# Altium project GeminiBoard.PrjPcb
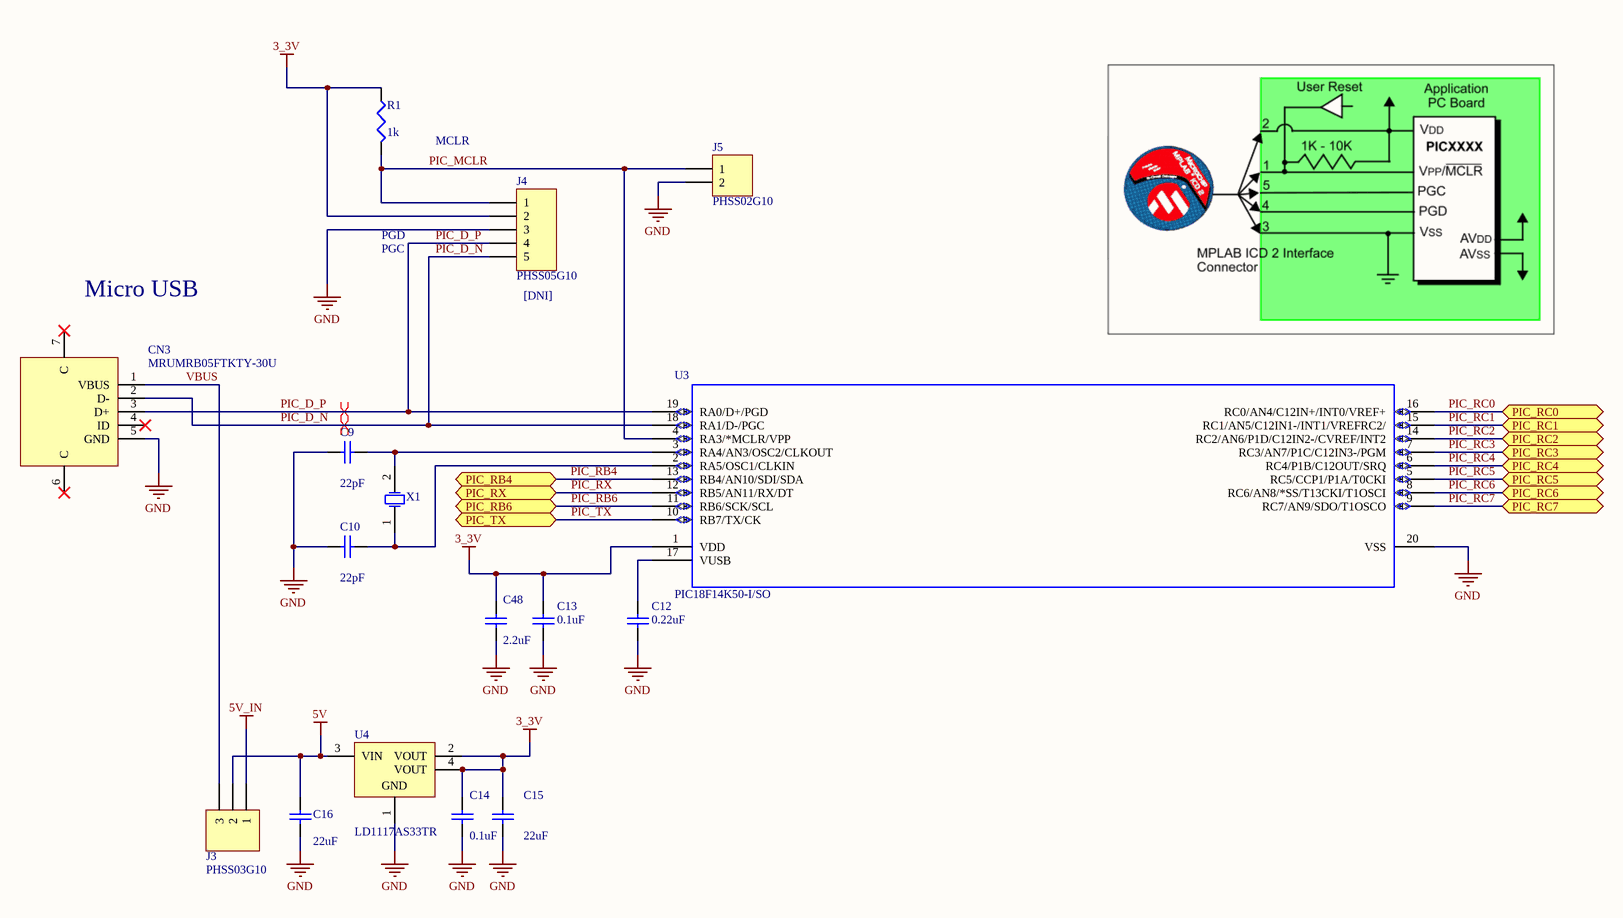
[diagram p0: Sheet1.SchDoc]
5 sheets, 117 parts. Net scope: flat (ports and power ports of the same name join across sheets).
Board file: PCB1.PcbDoc
Sheets:
  Sheet1.SchDoc
  Sheet2.SchDoc
  Sheet3.SchDoc
  Sheet4.SchDoc
  Sheet5.SchDoc

## Sheet Sheet1.SchDoc
size A3

### Parts
C9  value 22pF  [CHIP1608]  (hidden comment: 06035A220JAT2A)
C10  value 22pF  [CHIP1608]  (hidden comment: 06035A220JAT2A)
C12  value 0.22uF  [CHIP1608]  (hidden comment: CC0603ZRY5V7BB224)
C13  value 0.1uF  [CHIP1608]  (hidden comment: MC0603B104M160CT)
C14  value 0.1uF  [CHIP1608]  (hidden comment: MC0603B104M160CT)
C15  value 22uF  [CHIP3216]  (hidden comment: MC1206F226Z100CT)
C16  value 22uF  [CHIP3216]  (hidden comment: MC1206F226Z100CT)
C48  value 2.2uF  [CHIP1608]  (hidden comment: MC0603B225K6R3CT)
CN3  MRUMRB05FTKTY-30U  [MRUMRB05FTKTY-30U]
J3  PHSS03G10  [HDR1X3]
J4  PHSS05G10  assembly: [DNI]  [HDR1X5]
J5  PHSS02G10  [HDR1X2]
R1  value 1k  [CHIP1608]  (hidden comment: MCMR06X1001FTL)
U3  PIC18F14K50-I/SO  [PIC18F14K50-SO]
U4  LD1117AS33TR  [SOT-223_N]
X1  SMD49S-12M1630F  [ABLS-25.000MHZ-B2F-T]  (value not drawn)

### Ports
PIC_RB4, PIC_RB6, PIC_RC0, PIC_RC1, PIC_RC2, PIC_RC3, PIC_RC4, PIC_RC5, PIC_RC6, PIC_RC7, PIC_RX, PIC_TX

### Nets
3_3V: C13.2 C14.2 C15.2 C48.2 J4.2 R1.1 U3.1(VDD) U4.2(VOUT) U4.4(VOUT)
5V: C16.2 J3.2 U4.3(VIN)
5V_IN: J3.1
GND: C9.1 C10.1 C12.1 C13.1 C14.1 C15.1 C16.1 C48.1 CN3.5(GND) J4.3 J5.2 U3.20(VSS) U4.1(GND)
PIC_D_N: CN3.2(D-) J4.5 U3.18(RA1/D-/PGC)
PIC_D_P: CN3.3(D+) J4.4 U3.19(RA0/D+/PGD)
PIC_MCLR: J4.1 J5.1 R1.2 U3.4(RA3/*MCLR/VPP)
PIC_RB4: U3.13(RB4/AN10/SDI/SDA) ; port PIC_RB4
PIC_RB6: U3.11(RB6/SCK/SCL) ; port PIC_RB6
PIC_RC0: U3.16(RC0/AN4/C12IN+/INT0/VREF+) ; port PIC_RC0
PIC_RC1: U3.15(RC1/AN5/C12IN1-/INT1/VREFRC2/) ; port PIC_RC1
PIC_RC2: U3.14(RC2/AN6/P1D/C12IN2-/CVREF/INT2) ; port PIC_RC2
PIC_RC3: U3.7(RC3/AN7/P1C/C12IN3-/PGM) ; port PIC_RC3
PIC_RC4: U3.6(RC4/P1B/C12OUT/SRQ) ; port PIC_RC4
PIC_RC5: U3.5(RC5/CCP1/P1A/T0CKI) ; port PIC_RC5
PIC_RC6: U3.8(RC6/AN8/*SS/T13CKI/T1OSCI) ; port PIC_RC6
PIC_RC7: U3.9(RC7/AN9/SDO/T1OSCO) ; port PIC_RC7
PIC_RX: U3.12(RB5/AN11/RX/DT) ; port PIC_RX
PIC_TX: U3.10(RB7/TX/CK) ; port PIC_TX
VBUS: CN3.1(VBUS) J3.3
NetC9_2: C9.2 U3.3(RA4/AN3/OSC2/CLKOUT) X1.2(OSC2)
NetC10_2: C10.2 U3.2(RA5/OSC1/CLKIN) X1.1(OSC1)
NetC12_2: C12.2 U3.17(VUSB)

Not connected (* = marked no-connect by the designer): CN3 4(ID)* 6(C)* 7(C)*

### Layout directives
differential pair: PIC_D_N, PIC_D_P

### Notes on the sheet
- MCLR
- PGD
- PGC
- Micro USB

### Library data of the parts
C9 C10 C13 = Cap Semi: Capacitor (Semiconductor SIM Model); Published: 8-Jun-2000; LatestRevisionDate: 17-Jul-2002; LatestRevisionNote: Re-released for DXP Platform.; PackageReference: C1206; Publisher: Altium Limited
  C9 C10: part2: CC0603JRNPO9BN220
  C13: part2: CC0603KRX7R9BB104
C12 C14-C16 C48 = Cap Semi: Capacitor (Semiconductor SIM Model); Vendor: element14(GTI); Published: 8-Jun-2000; LatestRevisionDate: 17-Jul-2002; LatestRevisionNote: Re-released for DXP Platform.; PackageReference: C1206; Publisher: Altium Limited
  C12: part2: CC0603KRX7R8BB224
  C14: part2: CC0603KRX7R9BB104
  C15 C16: part2: CC1206KKX5R8BB226
  C48: part2: CC0603KRX7R6BB225
CN3 = MicroUSBTypeB: Vendor: ES; part2: 10118192-0001LF
J3 = Header 3: Header, 3-Pin; Vendor: ES; LatestRevisionDate: 17-Jul-2002; LatestRevisionNote: Re-released for DXP Platform.; Publisher: Altium Limited
J4 = Header 5: Header, 5-Pin; Vendor: ES; LatestRevisionDate: 17-Jul-2002; LatestRevisionNote: Re-released for DXP Platform.; Publisher: Altium Limited
J5 = Header 2: Header, 2-Pin; Vendor: ES; LatestRevisionDate: 17-Jul-2002; LatestRevisionNote: Re-released for DXP Platform.; Publisher: Altium Limited
R1 = Res3: Resistor; Published: 8-Jun-2000; LatestRevisionDate: 04-Mar-2005; LatestRevisionNote: PCB Footprint replaced.; PackageReference: J1-0603; Publisher: Altium Limited; part2: RC0603JR-071KL
U3 = PIC18F14K50: MICROCHIPS; Vendor: ES; part2: PIC18F14K50-I/SO
U4 = LD1117AS33TR: 1A, Low Drop Positive Voltage Regulator, 3.3V, 4-Pin SOT-223, Tape and Reel; Vendor: ES; DatasheetVersion: Dec-2011; PackageVersion: 2010; PackageReference: SOT-223; PackageDescription: 4-Pin SOT-223 Package, 6.5 x 3.5 mm Body, 2.3 mm Pitch, 7 mm Lead Span; PartNumber: LD1117AS33TR; ComponentLink1Description: Manufacturer URL; ComponentLink1URL: http://www.st.com; ComponentLink2Description: Datasheet; ComponentLink2URL: http://www.st.com/internet/com/TECHNICAL_RESOURCES/TECHNICAL_LITERATURE/DATASHEET/CD00002116.pdf; part2: LD1117AS33TR
X1 = ABLS-25.000MHZ-B2F-T: MEC; Vendor: ES; part2: ABLS-12.000MHZ-B4-T

## Sheet Sheet2.SchDoc
size A3
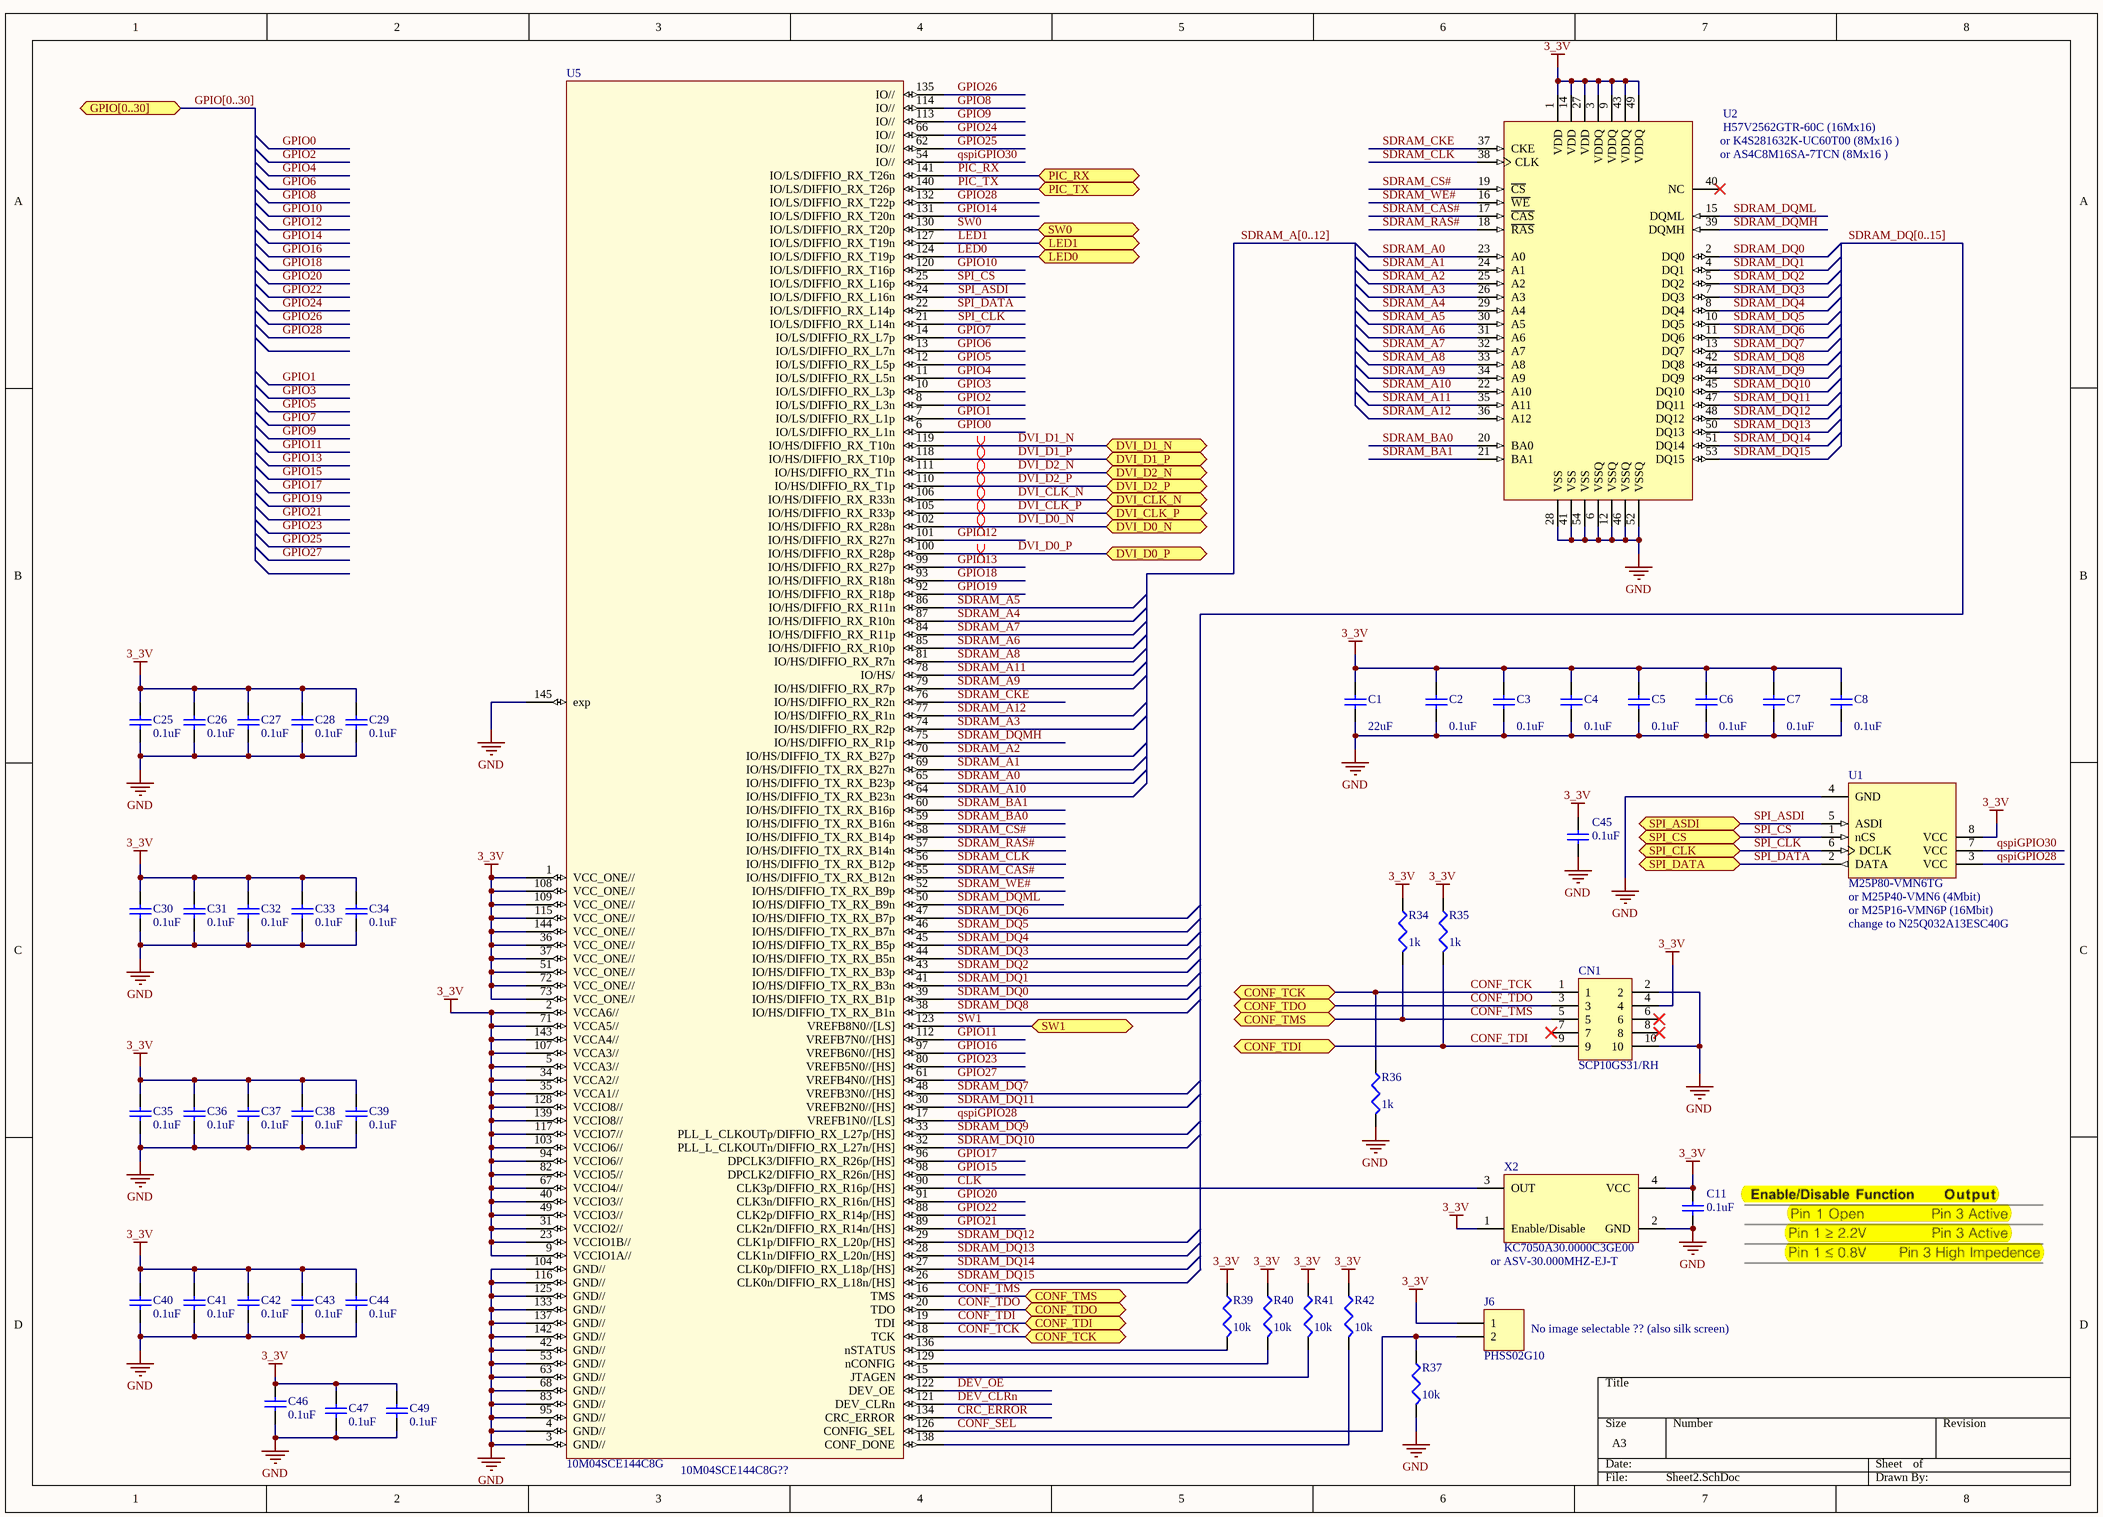
[diagram p1: Sheet2.SchDoc]

### Parts
C1  value 22uF  [CHIP3216]  (hidden comment: MC1206F226Z100CT)
C2  value 0.1uF  [CHIP1608]  (hidden comment: MC0603B104M160CT)
C3  value 0.1uF  [CHIP1608]  (hidden comment: MC0603B104M160CT)
C4  value 0.1uF  [CHIP1608]  (hidden comment: MC0603B104M160CT)
C5  value 0.1uF  [CHIP1608]  (hidden comment: MC0603B104M160CT)
C6  value 0.1uF  [CHIP1608]  (hidden comment: MC0603B104M160CT)
C7  value 0.1uF  [CHIP1608]  (hidden comment: MC0603B104M160CT)
C8  value 0.1uF  [CHIP1608]  (hidden comment: MC0603B104M160CT)
C11  value 0.1uF  [CHIP1608]  (hidden comment: MC0603B104M160CT)
C25  value 0.1uF  [CHIP1608]  (hidden comment: MC0603B104M160CT)
C26  value 0.1uF  [CHIP1608]  (hidden comment: MC0603B104M160CT)
C27  value 0.1uF  [CHIP1608]  (hidden comment: MC0603B104M160CT)
C28  value 0.1uF  [CHIP1608]  (hidden comment: MC0603B104M160CT)
C29  value 0.1uF  [CHIP1608]  (hidden comment: MC0603B104M160CT)
C30  value 0.1uF  [CHIP1608]  (hidden comment: MC0603B104M160CT)
C31  value 0.1uF  [CHIP1608]  (hidden comment: MC0603B104M160CT)
C32  value 0.1uF  [CHIP1608]  (hidden comment: MC0603B104M160CT)
C33  value 0.1uF  [CHIP1608]  (hidden comment: MC0603B104M160CT)
C34  value 0.1uF  [CHIP1608]  (hidden comment: MC0603B104M160CT)
C35  value 0.1uF  [CHIP1608]  (hidden comment: MC0603B104M160CT)
C36  value 0.1uF  [CHIP1608]  (hidden comment: MC0603B104M160CT)
C37  value 0.1uF  [CHIP1608]  (hidden comment: MC0603B104M160CT)
C38  value 0.1uF  [CHIP1608]  (hidden comment: MC0603B104M160CT)
C39  value 0.1uF  [CHIP1608]  (hidden comment: MC0603B104M160CT)
C40  value 0.1uF  [CHIP1608]  (hidden comment: MC0603B104M160CT)
C41  value 0.1uF  [CHIP1608]  (hidden comment: MC0603B104M160CT)
C42  value 0.1uF  [CHIP1608]  (hidden comment: MC0603B104M160CT)
C43  value 0.1uF  [CHIP1608]  (hidden comment: MC0603B104M160CT)
C44  value 0.1uF  [CHIP1608]  (hidden comment: MC0603B104M160CT)
C45  value 0.1uF  [CHIP1608]  (hidden comment: MC0603B104M160CT)
C46  value 0.1uF  [CHIP1608]  (hidden comment: MC0603B104M160CT)
C47  value 0.1uF  [CHIP1608]  (hidden comment: MC0603B104M160CT)
C49  value 0.1uF  [CHIP1608]  (hidden comment: MC0603B104M160CT)
CN1  SCP10GS31/RH  [SCP10GS31/RH]
J6  PHSS02G10  [HDR1X2]
R34  value 1k  [CHIP1608]  (hidden comment: MCMR06X1001FTL)
R35  value 1k  [CHIP1608]  (hidden comment: MCMR06X1001FTL)
R36  value 1k  [CHIP1608]  (hidden comment: MCMR06X1001FTL)
R37  value 10k  [CHIP1608]  (hidden comment: MCWR06X1002FTL)
R39  value 10k  [CHIP1608]  (hidden comment: MCWR06X1002FTL)
R40  value 10k  [CHIP1608]  (hidden comment: MCWR06X1002FTL)
R41  value 10k  [CHIP1608]  (hidden comment: MCWR06X1002FTL)
R42  value 10k  [CHIP1608]  (hidden comment: MCWR06X1002FTL)
U1  M25P80-VMN6TG  [SOIC8_L]
U2  H57V2562GTR-60C (16Mx16)  [TSOP2-54_M]
U5  10M04SCE144C8G  [TEST2]
X2  KC7050A30.0000C3GE00  [CWX823-50.0M]

### Ports
CONF_TCK, CONF_TDI, CONF_TDO, CONF_TMS, DVI_CLK_N, DVI_CLK_P, DVI_D0_N, DVI_D0_P, DVI_D1_N, DVI_D1_P, DVI_D2_N, DVI_D2_P, GPIO[0..30], LED0, LED1, PIC_RX, PIC_TX, SPI_ASDI, SPI_CLK, SPI_CS, SPI_DATA, SW0, SW1

### Nets
3_3V: C1.2 C2.2 C3.2 C4.2 C5.2 C6.2 C7.2 C8.2 C11.2 C25.1 C26.1 C27.1 C28.1 C29.1 C30.1 C31.1 C32.1 C33.1 C34.1 C35.1 C36.1 C37.1 C38.1 C39.1 C40.1 C41.1 C42.1 C43.1 C44.1 C45.2 C46.1 C47.1 C49.1 CN1.4 J6.1 R34.1 R35.1 R39.1 R40.1 R41.1 R42.1 U1.8(VCC) U2.1(VDD) U2.3(VDDQ) U2.9(VDDQ) U2.14(VDD) U2.27(VDD) U2.43(VDDQ) U2.49(VDDQ) U5.1(VCC_ONE//) U5.2(VCCA6//) U5.5(VCCA3//) U5.9(VCCIO1A//) U5.23(VCCIO1B//) U5.31(VCCIO2//) U5.34(VCCA2//) U5.35(VCCA1//) U5.36(VCC_ONE//) U5.37(VCC_ONE//) U5.40(VCCIO3//) U5.49(VCCIO3//) U5.51(VCC_ONE//) U5.67(VCCIO4//) U5.71(VCCA5//) U5.72(VCC_ONE//) U5.73(VCC_ONE//) U5.82(VCCIO5//) U5.94(VCCIO6//) U5.103(VCCIO6//) U5.107(VCCA3//) U5.108(VCC_ONE//) U5.109(VCC_ONE//) U5.115(VCC_ONE//) U5.117(VCCIO7//) U5.128(VCCIO8//) U5.139(VCCIO8//) U5.143(VCCA4//) U5.144(VCC_ONE//) X2.1(Enable/Disable) X2.4(VCC)
GND: C1.1 C2.1 C3.1 C4.1 C5.1 C6.1 C7.1 C8.1 C11.1 C25.2 C26.2 C27.2 C28.2 C29.2 C30.2 C31.2 C32.2 C33.2 C34.2 C35.2 C36.2 C37.2 C38.2 C39.2 C40.2 C41.2 C42.2 C43.2 C44.2 C45.1 C46.2 C47.2 C49.2 CN1.2 CN1.10 R36.2 R37.2 U1.4(GND) U2.6(VSSQ) U2.12(VSSQ) U2.28(VSS) U2.41(VSS) U2.46(VSSQ) U2.52(VSSQ) U2.54(VSS) U5.3(GND//) U5.4(GND//) U5.42(GND//) U5.53(GND//) U5.63(GND//) U5.68(GND//) U5.83(GND//) U5.95(GND//) U5.104(GND//) U5.116(GND//) U5.125(GND//) U5.133(GND//) U5.137(GND//) U5.142(GND//) U5.145(exp) X2.2(GND)
CLK: U5.90(CLK3p/DIFFIO_RX_R16p/[HS]) X2.3(OUT)
CONF_SEL: J6.2 R37.1 U5.126(CONFIG_SEL)
CONF_TCK: CN1.1 R36.1 U5.18(TCK) ; port CONF_TCK
CONF_TDI: CN1.9 R35.2 U5.19(TDI) ; port CONF_TDI
CONF_TDO: CN1.3 U5.20(TDO) ; port CONF_TDO
CONF_TMS: CN1.5 R34.2 U5.16(TMS) ; port CONF_TMS
CRC_ERROR: U5.134(CRC_ERROR)
DEV_CLRn: U5.121(DEV_CLRn)
DEV_OE: U5.122(DEV_OE)
DVI_CLK_N: U5.106(IO/HS/DIFFIO_RX_R33n) ; port DVI_CLK_N
DVI_CLK_P: U5.105(IO/HS/DIFFIO_RX_R33p) ; port DVI_CLK_P
DVI_D0_N: U5.102(IO/HS/DIFFIO_RX_R28n) ; port DVI_D0_N
DVI_D0_P: U5.100(IO/HS/DIFFIO_RX_R28p) ; port DVI_D0_P
DVI_D1_N: U5.119(IO/HS/DIFFIO_RX_T10n) ; port DVI_D1_N
DVI_D1_P: U5.118(IO/HS/DIFFIO_RX_T10p) ; port DVI_D1_P
DVI_D2_N: U5.111(IO/HS/DIFFIO_RX_T1n) ; port DVI_D2_N
DVI_D2_P: U5.110(IO/HS/DIFFIO_RX_T1p) ; port DVI_D2_P
GPIO0: U5.6(IO/LS/DIFFIO_RX_L1n)
GPIO1: U5.7(IO/LS/DIFFIO_RX_L1p)
GPIO2: U5.8(IO/LS/DIFFIO_RX_L3n)
GPIO3: U5.10(IO/LS/DIFFIO_RX_L3p)
GPIO4: U5.11(IO/LS/DIFFIO_RX_L5n)
GPIO5: U5.12(IO/LS/DIFFIO_RX_L5p)
GPIO6: U5.13(IO/LS/DIFFIO_RX_L7n)
GPIO7: U5.14(IO/LS/DIFFIO_RX_L7p)
GPIO8: U5.114(IO//)
GPIO9: U5.113(IO//)
GPIO10: U5.120(IO/LS/DIFFIO_RX_T16p)
GPIO11: U5.112(VREFB7N0//[HS])
GPIO12: U5.101(IO/HS/DIFFIO_RX_R27n)
GPIO13: U5.99(IO/HS/DIFFIO_RX_R27p)
GPIO14: U5.131(IO/LS/DIFFIO_RX_T20n)
GPIO15: U5.98(DPCLK2/DIFFIO_RX_R26n/[HS])
GPIO16: U5.97(VREFB6N0//[HS])
GPIO17: U5.96(DPCLK3/DIFFIO_RX_R26p/[HS])
GPIO18: U5.93(IO/HS/DIFFIO_RX_R18n)
GPIO19: U5.92(IO/HS/DIFFIO_RX_R18p)
GPIO20: U5.91(CLK3n/DIFFIO_RX_R16n/[HS])
GPIO21: U5.89(CLK2n/DIFFIO_RX_R14n/[HS])
GPIO22: U5.88(CLK2p/DIFFIO_RX_R14p/[HS])
GPIO23: U5.80(VREFB5N0//[HS])
GPIO24: U5.66(IO//)
GPIO25: U5.62(IO//)
GPIO26: U5.135(IO//)
GPIO27: U5.61(VREFB4N0//[HS])
GPIO28: U5.132(IO/LS/DIFFIO_RX_T22p)
LED0: U5.124(IO/LS/DIFFIO_RX_T19p) ; port LED0
LED1: U5.127(IO/LS/DIFFIO_RX_T19n) ; port LED1
PIC_RX: U5.141(IO/LS/DIFFIO_RX_T26n) ; port PIC_RX
PIC_TX: U5.140(IO/LS/DIFFIO_RX_T26p) ; port PIC_TX
qspiGPIO28: U1.3(VCC) U5.17(VREFB1N0//[LS])
qspiGPIO30: U1.7(VCC) U5.54(IO//)
SDRAM_A0: U2.23(A0) U5.65(IO/HS/DIFFIO_TX_RX_B23p)
SDRAM_A1: U2.24(A1) U5.69(IO/HS/DIFFIO_TX_RX_B27n)
SDRAM_A2: U2.25(A2) U5.70(IO/HS/DIFFIO_TX_RX_B27p)
SDRAM_A3: U2.26(A3) U5.74(IO/HS/DIFFIO_RX_R2p)
SDRAM_A4: U2.29(A4) U5.87(IO/HS/DIFFIO_RX_R10n)
SDRAM_A5: U2.30(A5) U5.86(IO/HS/DIFFIO_RX_R11n)
SDRAM_A6: U2.31(A6) U5.85(IO/HS/DIFFIO_RX_R10p)
SDRAM_A7: U2.32(A7) U5.84(IO/HS/DIFFIO_RX_R11p)
SDRAM_A8: U2.33(A8) U5.81(IO/HS/DIFFIO_RX_R7n)
SDRAM_A9: U2.34(A9) U5.79(IO/HS/DIFFIO_RX_R7p)
SDRAM_A10: U2.22(A10) U5.64(IO/HS/DIFFIO_TX_RX_B23n)
SDRAM_A11: U2.35(A11) U5.78(IO/HS/)
SDRAM_A12: U2.36(A12) U5.77(IO/HS/DIFFIO_RX_R1n)
SDRAM_BA0: U2.20(BA0) U5.59(IO/HS/DIFFIO_TX_RX_B16n)
SDRAM_BA1: U2.21(BA1) U5.60(IO/HS/DIFFIO_TX_RX_B16p)
SDRAM_CAS#: U2.17(~{CAS}) U5.55(IO/HS/DIFFIO_TX_RX_B12n)
SDRAM_CKE: U2.37(CKE) U5.76(IO/HS/DIFFIO_RX_R2n)
SDRAM_CLK: U2.38(CLK) U5.56(IO/HS/DIFFIO_TX_RX_B12p)
SDRAM_CS#: U2.19(~{CS}) U5.58(IO/HS/DIFFIO_TX_RX_B14p)
SDRAM_DQ0: U2.2(DQ0) U5.39(IO/HS/DIFFIO_TX_RX_B1p)
SDRAM_DQ1: U2.4(DQ1) U5.41(IO/HS/DIFFIO_TX_RX_B3n)
SDRAM_DQ2: U2.5(DQ2) U5.43(IO/HS/DIFFIO_TX_RX_B3p)
SDRAM_DQ3: U2.7(DQ3) U5.44(IO/HS/DIFFIO_TX_RX_B5n)
SDRAM_DQ4: U2.8(DQ4) U5.45(IO/HS/DIFFIO_TX_RX_B5p)
SDRAM_DQ5: U2.10(DQ5) U5.46(IO/HS/DIFFIO_TX_RX_B7n)
SDRAM_DQ6: U2.11(DQ6) U5.47(IO/HS/DIFFIO_TX_RX_B7p)
SDRAM_DQ7: U2.13(DQ7) U5.48(VREFB3N0//[HS])
SDRAM_DQ8: U2.42(DQ8) U5.38(IO/HS/DIFFIO_TX_RX_B1n)
SDRAM_DQ9: U2.44(DQ9) U5.33(PLL_L_CLKOUTp/DIFFIO_RX_L27p/[HS])
SDRAM_DQ10: U2.45(DQ10) U5.32(PLL_L_CLKOUTn/DIFFIO_RX_L27n/[HS])
SDRAM_DQ11: U2.47(DQ11) U5.30(VREFB2N0//[HS])
SDRAM_DQ12: U2.48(DQ12) U5.29(CLK1p/DIFFIO_RX_L20p/[HS])
SDRAM_DQ13: U2.50(DQ13) U5.28(CLK1n/DIFFIO_RX_L20n/[HS])
SDRAM_DQ14: U2.51(DQ14) U5.27(CLK0p/DIFFIO_RX_L18p/[HS])
SDRAM_DQ15: U2.53(DQ15) U5.26(CLK0n/DIFFIO_RX_L18n/[HS])
SDRAM_DQMH: U2.39(DQMH) U5.75(IO/HS/DIFFIO_RX_R1p)
SDRAM_DQML: U2.15(DQML) U5.50(IO/HS/DIFFIO_TX_RX_B9n)
SDRAM_RAS#: U2.18(~{RAS}) U5.57(IO/HS/DIFFIO_TX_RX_B14n)
SDRAM_WE#: U2.16(~{WE}) U5.52(IO/HS/DIFFIO_TX_RX_B9p)
SPI_ASDI: U1.5(ASDI) U5.24(IO/LS/DIFFIO_RX_L16n) ; port SPI_ASDI
SPI_CLK: U1.6(DCLK) U5.21(IO/LS/DIFFIO_RX_L14n) ; port SPI_CLK
SPI_CS: U1.1(nCS) U5.25(IO/LS/DIFFIO_RX_L16p) ; port SPI_CS
SPI_DATA: U1.2(DATA) U5.22(IO/LS/DIFFIO_RX_L14p) ; port SPI_DATA
SW0: U5.130(IO/LS/DIFFIO_RX_T20p) ; port SW0
SW1: U5.123(VREFB8N0//[LS]) ; port SW1
NetR39_2: R39.2 U5.136(nSTATUS)
NetR40_2: R40.2 U5.129(nCONFIG)
NetR41_2: R41.2 U5.15(JTAGEN)
NetR42_2: R42.2 U5.138(CONF_DONE)

Not connected (* = marked no-connect by the designer): CN1 6* 7* 8*; U2 40(NC)*

### Buses and harness runs
bus GPIO[0..30] = port GPIO[0..30]
bus SDRAM_A[0..12]
bus SDRAM_DQ[0..15]

### Layout directives
differential pair: DVI_CLK_N, DVI_CLK_P, DVI_D0_N, DVI_D0_P, DVI_D1_N, DVI_D1_P, DVI_D2_N, DVI_D2_P

### Notes on the sheet
- (near U2) or K4S281632K-UC60T00 (8Mx16 )
- (near U2) or AS4C8M16SA-7TCN (8Mx16 )
- (near U1) or M25P40-VMN6 (4Mbit)
- (near U1) or M25P16-VMN6P (16Mbit)
- change to N25Q032A13ESC40G
- (near X2) or ASV-30.000MHZ-EJ-T
- (near J6) No image selectable ?? (also silk screen)
- (near U5) 10M04SCE144C8G??

### Library data of the parts
C1 = Cap Semi: as C12 on sheet Sheet1; Published: 8-Jun-2000; LatestRevisionDate: 17-Jul-2002; LatestRevisionNote: Re-released for DXP Platform.; PackageReference: C1206; Publisher: Altium Limited; part2: CC1206KKX5R8BB226
C2-C8 C11 C25-C47 C49 = Cap Semi: Capacitor (Semiconductor SIM Model); Published: 8-Jun-2000; LatestRevisionDate: 17-Jul-2002; LatestRevisionNote: Re-released for DXP Platform.; PackageReference: C1206; Publisher: Altium Limited; part2: CC0603KRX7R9BB104
CN1 = SCP10GS31/RH: GTK; Vendor: ES
J6 = Header 2: Header, 2-Pin; Vendor: ES; LatestRevisionDate: 17-Jul-2002; LatestRevisionNote: Re-released for DXP Platform.; Publisher: Altium Limited
R34-R37 R39-R42 = Res3: Resistor; Published: 8-Jun-2000; LatestRevisionDate: 04-Mar-2005; LatestRevisionNote: PCB Footprint replaced.; PackageReference: J1-0603; Publisher: Altium Limited
  R34-R36: part2: RC0603JR-071KL
  R37 R39-R42: part2: RC0603JR-0710KL
U1 = EPCS1SI8: ALTERA EPCS1 Series, In-system programmable 3.3V serial configuration device, 8-Pin SOIC, 1-Megabit, Industrial Grade; Configures: Cyclone II, Stratix II, & Cyclone Devices; Vendor: ES or RS; Published: 17-Sep-2003; LatestRevisionDate: 13-Apr-2006; LatestRevisionNote: IPC-7351 Footprint Added.; DatasheetVersion: ver2.0, Oct-2003; PackageVersion: ver13.0, May-2005; PackageReference: SOIC8; Publisher: Altium Limited; PackageDescription: 8-Pin Small Outline Integrated Circuit Package (SOIC8); Code_JEDEC: MS-012-AA; Code_IPC: SOIC127P600-8; ComponentLink1Description: Manufacturer Link; ComponentLink1URL: http://www.altera.com/products/devices/config/cfg-index.html; ComponentLink2Description: Configuration Handbook; ComponentLink2URL: http://www.altera.com/literature/hb/cfg/config_handbook.pdf; ComponentLink3Description: Pinout Specification; ComponentLink3URL: http://www.altera.com/literature/hb/cfg/cyc_c51014.pdf; ComponentLink4Description: Packaging Specification; ComponentLink4URL: http://www.altera.com/literature/ds/dspkg.pdf; part2: N25Q032A13ESC40G
U2 = MT48LC16M16A2TG-75: MICRON; CycleTime: 7.5ns @ CL = 3 (PC133); RowAddress: 8K (A0-A12); ColumnAddress: 512 (A0-A8); Vendor: ES; Published: 11-Oct-2004; LatestRevisionDate: 13-Apr-2006; LatestRevisionNote: IPC-7351 Footprint Added.; DatasheetVersion: rev.G, Sep-2003; PackageVersion: Sep-2003; PackageReference: TSOP2-54; Publisher: Altium Limited; PackageDescription: 54-Pin Plastic Small Outline Package 0.8 mm Pitch; Code_JEDEC: MS-024-FA; ComponentLink1Description: Manufacturer Link; ComponentLink1URL: http://www.micron.com; ComponentLink2Description: Datasheet; ComponentLink2URL: http://download.micron.com/pdf/datasheets/dram/sdram/256MSDRAM.pdf; part2: AS4C8M16SA-7TCN
U5 = MAX10: Vendor: Mouser; part2: 10M04SCE144C8G
X2 = CWX823-50.0M: CONNOR-WINFIELD; Vendor: ES; part2: ASV-30.000MHZ-EJ-T

## Sheet Sheet3.SchDoc
size A3
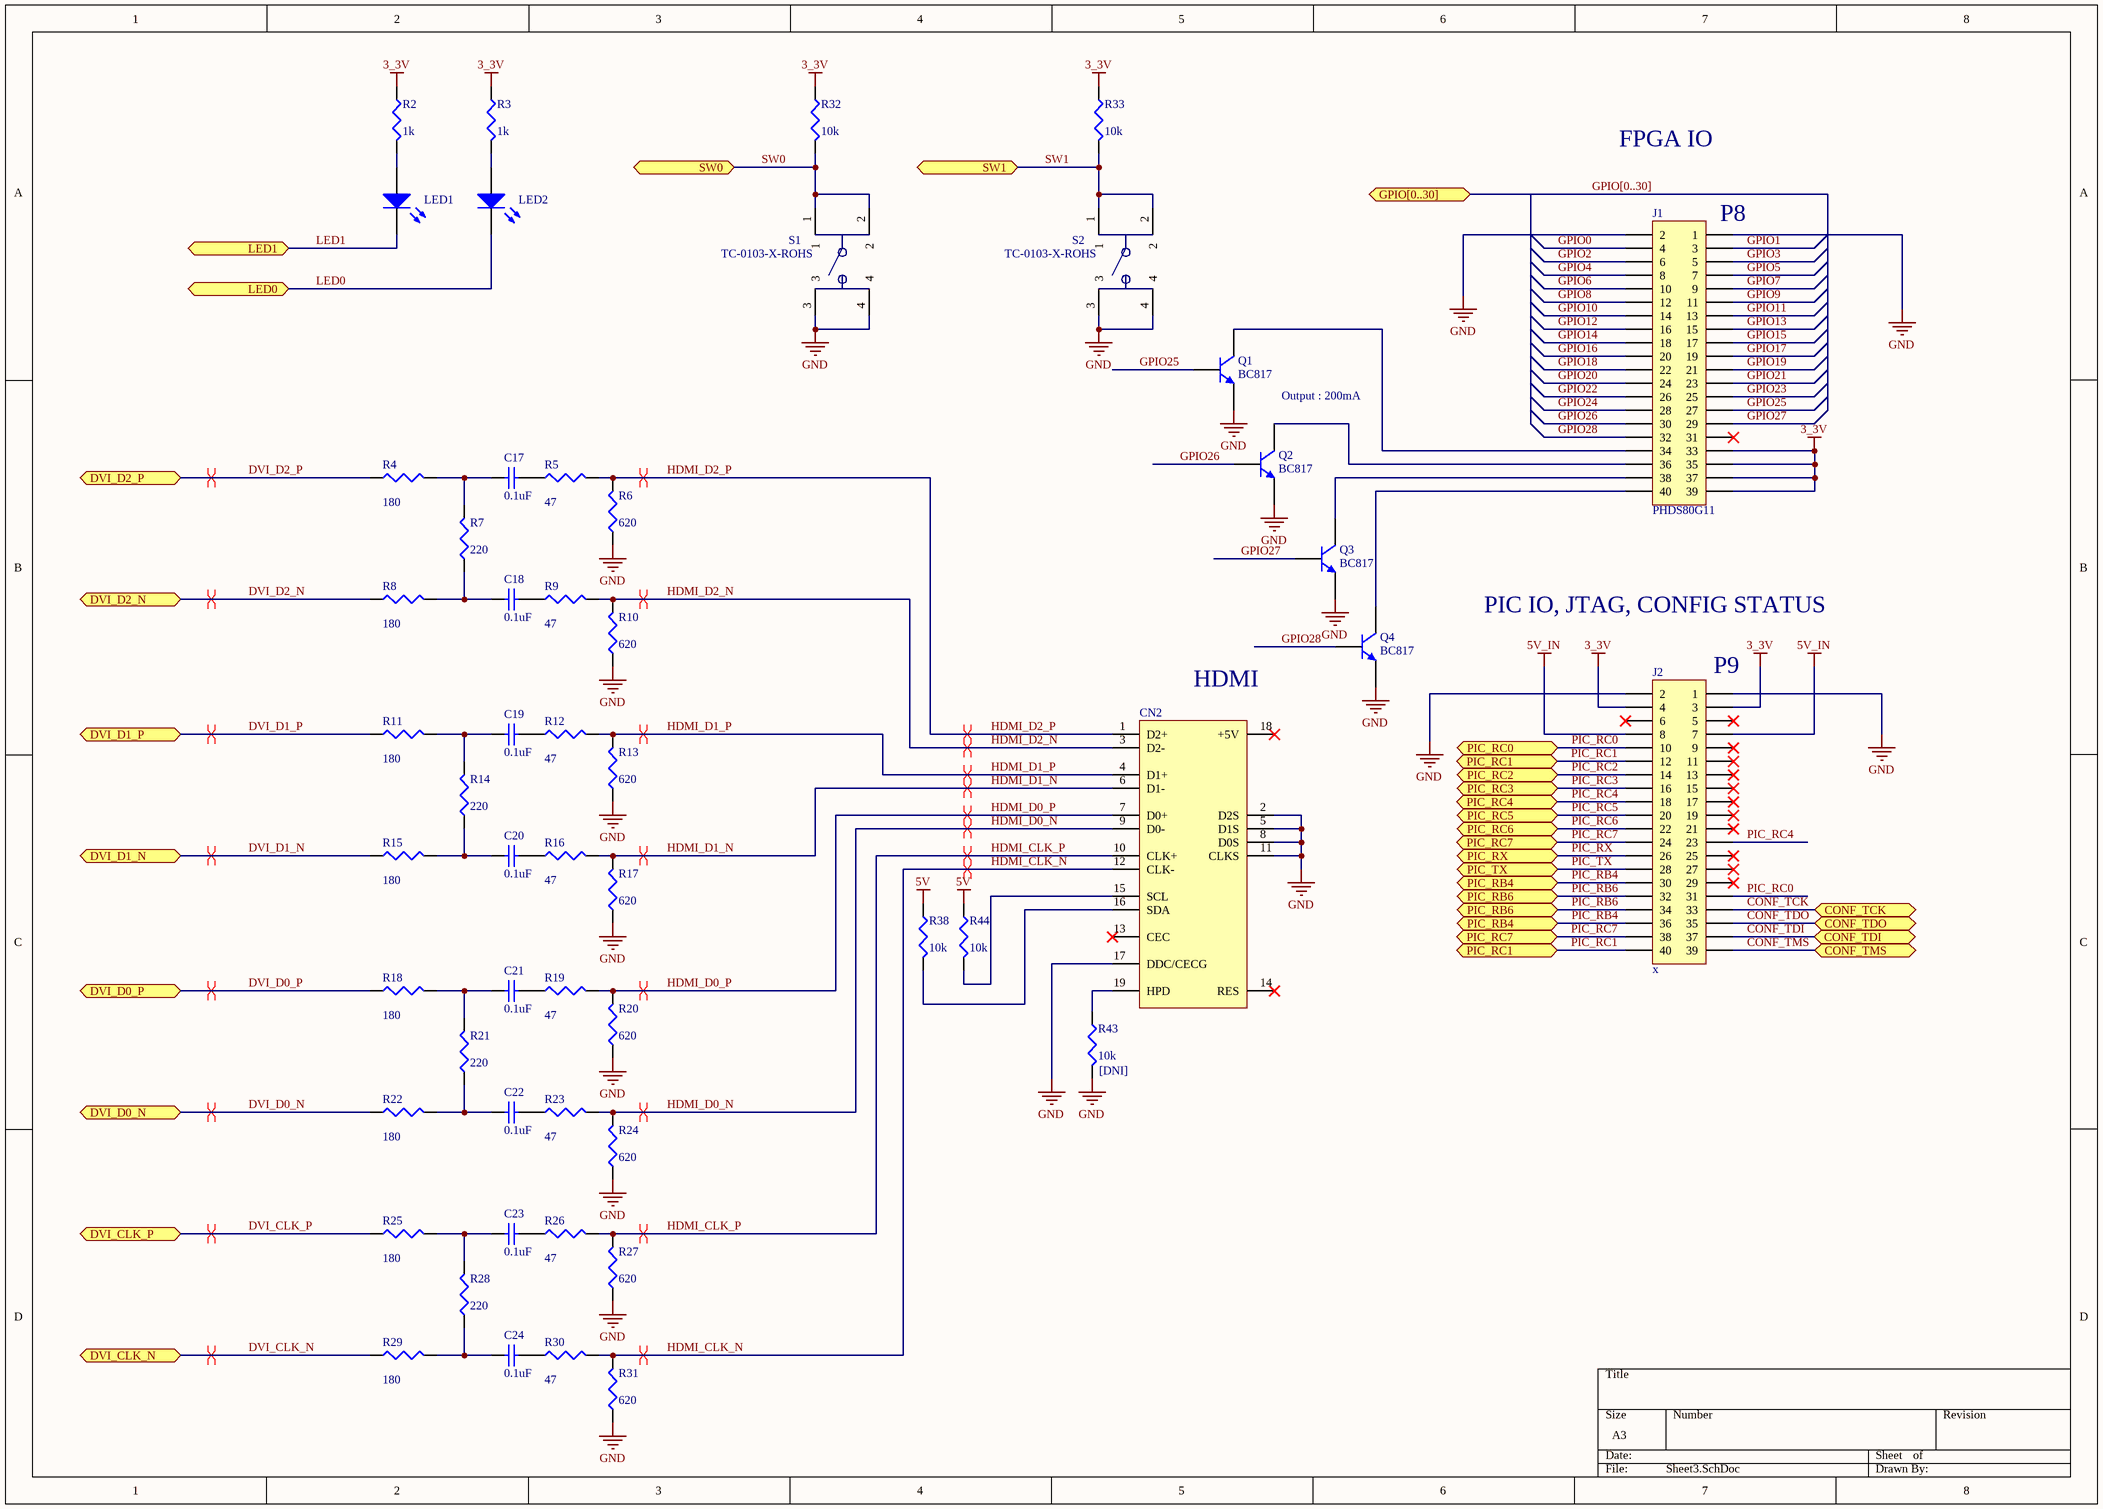
[diagram p2: Sheet3.SchDoc]

### Parts
C17  value 0.1uF  [CHIP1608]  (hidden comment: MCWR06X000 PTL)
C18  value 0.1uF  [CHIP1608]  (hidden comment: MCWR06X000 PTL)
C19  value 0.1uF  [CHIP1608]  (hidden comment: MCWR06X000 PTL)
C20  value 0.1uF  [CHIP1608]  (hidden comment: MCWR06X000 PTL)
C21  value 0.1uF  [CHIP1608]  (hidden comment: MCWR06X000 PTL)
C22  value 0.1uF  [CHIP1608]  (hidden comment: MCWR06X000 PTL)
C23  value 0.1uF  [CHIP1608]  (hidden comment: MCWR06X000 PTL)
C24  value 0.1uF  [CHIP1608]  (hidden comment: MCWR06X000 PTL)
CN2  10029449-001RLF  [10029449-001RLF]  (value not drawn)
J1  PHDS80G11  [HDR2X20-Gemini]
J2  x  [HDR2X20-Gemini]
LED1  TO-3216BC-MAE  [LED3216]  (value not drawn)
LED2  TO-3216BC-MAE  [LED3216]  (value not drawn)
Q1  BC817  [SOT-23]
Q2  BC817  [SOT-23]
Q3  BC817  [SOT-23]
Q4  BC817  [SOT-23]
R2  value 1k  [CHIP1608]  (hidden comment: MCMR06X1001FTL)
R3  value 1k  [CHIP1608]  (hidden comment: MCMR06X1001FTL)
R4  value 180  [CHIP1608]  (hidden comment: MC0063W06031270R)
R5  value 47  [CHIP1608]  (hidden comment: MCWR06X000 PTL)
R6  value 620  [CHIP1608]  (hidden comment: MCMR06X1001FTL)
R7  value 220  [CHIP1608]  (hidden comment: MCMR06X1001FTL)
R8  value 180  [CHIP1608]  (hidden comment: MC0063W06031270R)
R9  value 47  [CHIP1608]  (hidden comment: MCWR06X000 PTL)
R10  value 620  [CHIP1608]  (hidden comment: MCMR06X1001FTL)
R11  value 180  [CHIP1608]  (hidden comment: MC0063W06031270R)
R12  value 47  [CHIP1608]  (hidden comment: MCWR06X000 PTL)
R13  value 620  [CHIP1608]  (hidden comment: MCMR06X1001FTL)
R14  value 220  [CHIP1608]  (hidden comment: MCMR06X1001FTL)
R15  value 180  [CHIP1608]  (hidden comment: MC0063W06031270R)
R16  value 47  [CHIP1608]  (hidden comment: MCWR06X000 PTL)
R17  value 620  [CHIP1608]  (hidden comment: MCMR06X1001FTL)
R18  value 180  [CHIP1608]  (hidden comment: MC0063W06031270R)
R19  value 47  [CHIP1608]  (hidden comment: MCWR06X000 PTL)
R20  value 620  [CHIP1608]  (hidden comment: MCMR06X1001FTL)
R21  value 220  [CHIP1608]  (hidden comment: MCMR06X1001FTL)
R22  value 180  [CHIP1608]  (hidden comment: MC0063W06031270R)
R23  value 47  [CHIP1608]  (hidden comment: MCWR06X000 PTL)
R24  value 620  [CHIP1608]  (hidden comment: MCMR06X1001FTL)
R25  value 180  [CHIP1608]  (hidden comment: MC0063W06031270R)
R26  value 47  [CHIP1608]  (hidden comment: MCWR06X000 PTL)
R27  value 620  [CHIP1608]  (hidden comment: MCMR06X1001FTL)
R28  value 220  [CHIP1608]  (hidden comment: MCMR06X1001FTL)
R29  value 180  [CHIP1608]  (hidden comment: MC0063W06031270R)
R30  value 47  [CHIP1608]  (hidden comment: MCWR06X000 PTL)
R31  value 620  [CHIP1608]  (hidden comment: MCMR06X1001FTL)
R32  value 10k  [CHIP1608]  (hidden comment: MCWR06X1002FTL)
R33  value 10k  [CHIP1608]  (hidden comment: MCWR06X1002FTL)
R38  value 10k  [CHIP1608]  (hidden comment: MCWR06X1002FTL)
R43  value 10k  assembly: [DNI]  [CHIP1608]  (hidden comment: MCWR06X1002FTL)
R44  value 10k  [CHIP1608]  (hidden comment: MCWR06X1002FTL)
S1  TC-0103-X-ROHS  [TACK_SW 6x6mm]
S2  TC-0103-X-ROHS  [TACK_SW 6x6mm]

### Ports
CONF_TCK, CONF_TDI, CONF_TDO, CONF_TMS, DVI_CLK_N, DVI_CLK_P, DVI_D0_N, DVI_D0_P, DVI_D1_N, DVI_D1_P, DVI_D2_N, DVI_D2_P, GPIO[0..30], LED0, LED1, PIC_RB4, PIC_RB6, PIC_RC0, PIC_RC1, PIC_RC2, PIC_RC3, PIC_RC4, PIC_RC5, PIC_RC6, PIC_RC7, PIC_RX, PIC_TX, SW0, SW1

### Nets
3_3V: J1.33 J1.35 J1.37 J1.39 J2.3 J2.4 R2.1 R3.1 R32.1 R33.1
5V: R38.1 R44.1
5V_IN: J2.7 J2.8
GND: CN2.2(D2S) CN2.5(D1S) CN2.8(D0S) CN2.11(CLKS) CN2.17(DDC/CECG) J1.1 J1.2 J2.1 J2.2 Q1.2(E) Q2.2(E) Q3.2(E) Q4.2(E) R6.1 R10.1 R13.1 R17.1 R20.1 R24.1 R27.1 R31.1 R43.2 S1.3 S1.4 S2.3 S2.4
CONF_TCK: J2.33 ; port CONF_TCK
CONF_TDI: J2.37 ; port CONF_TDI
CONF_TDO: J2.35 ; port CONF_TDO
CONF_TMS: J2.39 ; port CONF_TMS
DVI_CLK_N: R29.1 ; port DVI_CLK_N
DVI_CLK_P: R25.1 ; port DVI_CLK_P
DVI_D0_N: R22.1 ; port DVI_D0_N
DVI_D0_P: R18.1 ; port DVI_D0_P
DVI_D1_N: R15.1 ; port DVI_D1_N
DVI_D1_P: R11.1 ; port DVI_D1_P
DVI_D2_N: R8.1 ; port DVI_D2_N
DVI_D2_P: R4.1 ; port DVI_D2_P
GPIO0: J1.4
GPIO1: J1.3
GPIO2: J1.6
GPIO3: J1.5
GPIO4: J1.8
GPIO5: J1.7
GPIO6: J1.10
GPIO7: J1.9
GPIO8: J1.12
GPIO9: J1.11
GPIO10: J1.14
GPIO11: J1.13
GPIO12: J1.16
GPIO13: J1.15
GPIO14: J1.18
GPIO15: J1.17
GPIO16: J1.20
GPIO17: J1.19
GPIO18: J1.22
GPIO19: J1.21
GPIO20: J1.24
GPIO21: J1.23
GPIO22: J1.26
GPIO23: J1.25
GPIO24: J1.28
GPIO25: J1.27 Q1.1(B)
GPIO26: J1.30 Q2.1(B)
GPIO27: J1.29 Q3.1(B)
GPIO28: J1.32 Q4.1(B)
HDMI_CLK_N: CN2.12(CLK-) R30.2 R31.2
HDMI_CLK_P: CN2.10(CLK+) R26.2 R27.2
HDMI_D0_N: CN2.9(D0-) R23.2 R24.2
HDMI_D0_P: CN2.7(D0+) R19.2 R20.2
HDMI_D1_N: CN2.6(D1-) R16.2 R17.2
HDMI_D1_P: CN2.4(D1+) R12.2 R13.2
HDMI_D2_N: CN2.3(D2-) R9.2 R10.2
HDMI_D2_P: CN2.1(D2+) R5.2 R6.2
LED0: LED2.2(K) ; port LED0
LED1: LED1.2(K) ; port LED1
PIC_RB4: J2.30 J2.36 ; port PIC_RB4
PIC_RB6: J2.32 J2.34 ; port PIC_RB6
PIC_RC0: J2.10 J2.31 ; port PIC_RC0
PIC_RC1: J2.12 J2.40 ; port PIC_RC1
PIC_RC2: J2.14 ; port PIC_RC2
PIC_RC3: J2.16 ; port PIC_RC3
PIC_RC4: J2.18 J2.23 ; port PIC_RC4
PIC_RC5: J2.20 ; port PIC_RC5
PIC_RC6: J2.22 ; port PIC_RC6
PIC_RC7: J2.24 J2.38 ; port PIC_RC7
PIC_RX: J2.26 ; port PIC_RX
PIC_TX: J2.28 ; port PIC_TX
SW0: R32.2 S1.1 S1.2 ; port SW0
SW1: R33.2 S2.1 S2.2 ; port SW1
NetC17_1: C17.1 R5.1
NetC17_2: C17.2 R4.2 R7.2
NetC18_1: C18.1 R9.1
NetC18_2: C18.2 R7.1 R8.2
NetC19_1: C19.1 R12.1
NetC19_2: C19.2 R11.2 R14.2
NetC20_1: C20.1 R16.1
NetC20_2: C20.2 R14.1 R15.2
NetC21_1: C21.1 R19.1
NetC21_2: C21.2 R18.2 R21.2
NetC22_1: C22.1 R23.1
NetC22_2: C22.2 R21.1 R22.2
NetC23_1: C23.1 R26.1
NetC23_2: C23.2 R25.2 R28.2
NetC24_1: C24.1 R30.1
NetC24_2: C24.2 R28.1 R29.2
NetCN2_15: CN2.15(SCL) R44.2
NetCN2_16: CN2.16(SDA) R38.2
NetCN2_19: CN2.19(HPD) R43.1
NetJ1_34: J1.34 Q1.3(C)
NetJ1_36: J1.36 Q2.3(C)
NetJ1_38: J1.38 Q3.3(C)
NetJ1_40: J1.40 Q4.3(C)
NetLED1_1: LED1.1(A) R2.2
NetLED2_1: LED2.1(A) R3.2

Not connected (* = marked no-connect by the designer): CN2 13(CEC)* 14(RES)* 18(+5V)*; J1 31*; J2 5* 6* 9* 11* 13* 15* 17* 19* 21* 25* 27* 29*

### Buses and harness runs
bus GPIO[0..30] = port GPIO[0..30]

### Layout directives
differential pair: DVI_CLK_N, DVI_CLK_P, DVI_D0_N, DVI_D0_P, DVI_D1_N, DVI_D1_P, DVI_D2_N, DVI_D2_P, HDMI_CLK_N, HDMI_CLK_P, HDMI_D0_N, HDMI_D0_P, HDMI_D1_N, HDMI_D1_P, HDMI_D2_N, HDMI_D2_P

### Notes on the sheet
- FPGA IO
- (near J1) P8
- Output : 200mA
- PIC IO, JTAG, CONFIG STATUS
- (near CN2) HDMI
- (near J2) P9

### Library data of the parts
C17-C24 = Cap Semi: Capacitor (Semiconductor SIM Model); Published: 8-Jun-2000; LatestRevisionDate: 17-Jul-2002; LatestRevisionNote: Re-released for DXP Platform.; PackageReference: C1206; Publisher: Altium Limited; part2: CC0603KRX7R9BB104
CN2 = HDMI_Connector: Vendor: Mouser -> maybe element (connector may have to pay TAX); part2: 10029449-001RLF
J1 J2 = Header 20X2: Header, 20-Pin, Dual row; Vendor: ES; LatestRevisionDate: 17-Jul-2002; LatestRevisionNote: Re-released for DXP Platform.; Publisher: Altium Limited
LED1 LED2 = LED2: OASISTEK (TO-3216BC-MAE); Vendor: ES; Published: 8-Jun-2000; LatestRevisionDate: 17-Jul-2002; LatestRevisionNote: Re-released for DXP Platform.; PackageDocument: Feb-2002; PackageReference: 3.2X1.6X1.1; Publisher: Altium Limited; part2: APTR3216SGC
Q1-Q4 = BC817: NPN General Purpose Amplifier; Published: 8-Jun-2000; LatestRevisionDate: 15-Jan-2003; LatestRevisionNote: PCB Footprint 'BCY-W3/D4.7' replaced; DatasheetVersion: 1997; PackageVersion: Sep-1998; PackageReference: TO-92A; Publisher: Altium Limited; PackageDescription: TO, Flat Index; 3 In-Line, Axial Leads; Body Dia. 4.5mm; Leads 0.51 x 0.48 mm (max); ComponentLink1Description: Manufacturer Link; ComponentLink1URL: http://www.fairchildsemi.com/; ComponentLink2Description: Datasheet; ComponentLink2URL: http://www.fairchildsemi.com/ds/2N%2F2N3904.pdf; part2: MMBT3904LT1G
R2-R33 R38 R43 R44 = Res3: Resistor; Published: 8-Jun-2000; LatestRevisionDate: 04-Mar-2005; LatestRevisionNote: PCB Footprint replaced.; PackageReference: J1-0603; Publisher: Altium Limited
  R2 R3: part2: RC0603JR-071KL
  R4 R8 R11 R15 R18 R22 R25 R29: part2: RC0603FR-07180RL
  R5 R9 R12 R16 R19 R23 R26 R30: part2: RC0603FR-0747RL
  R6 R10 R13 R17 R20 R24 R27 R31: part2: RC0603FR-07620RL
  R7 R14 R21 R28: part2: RC0603FR-07220RL
  R32 R33 R38 R43 R44: part2: RC0603JR-0710KL
S1 S2 = TC-0103-X-ROHS: WEALTH METAL; Vendor: ES

## Sheet Sheet4.SchDoc
size A3

## Sheet Sheet5.SchDoc
size A3
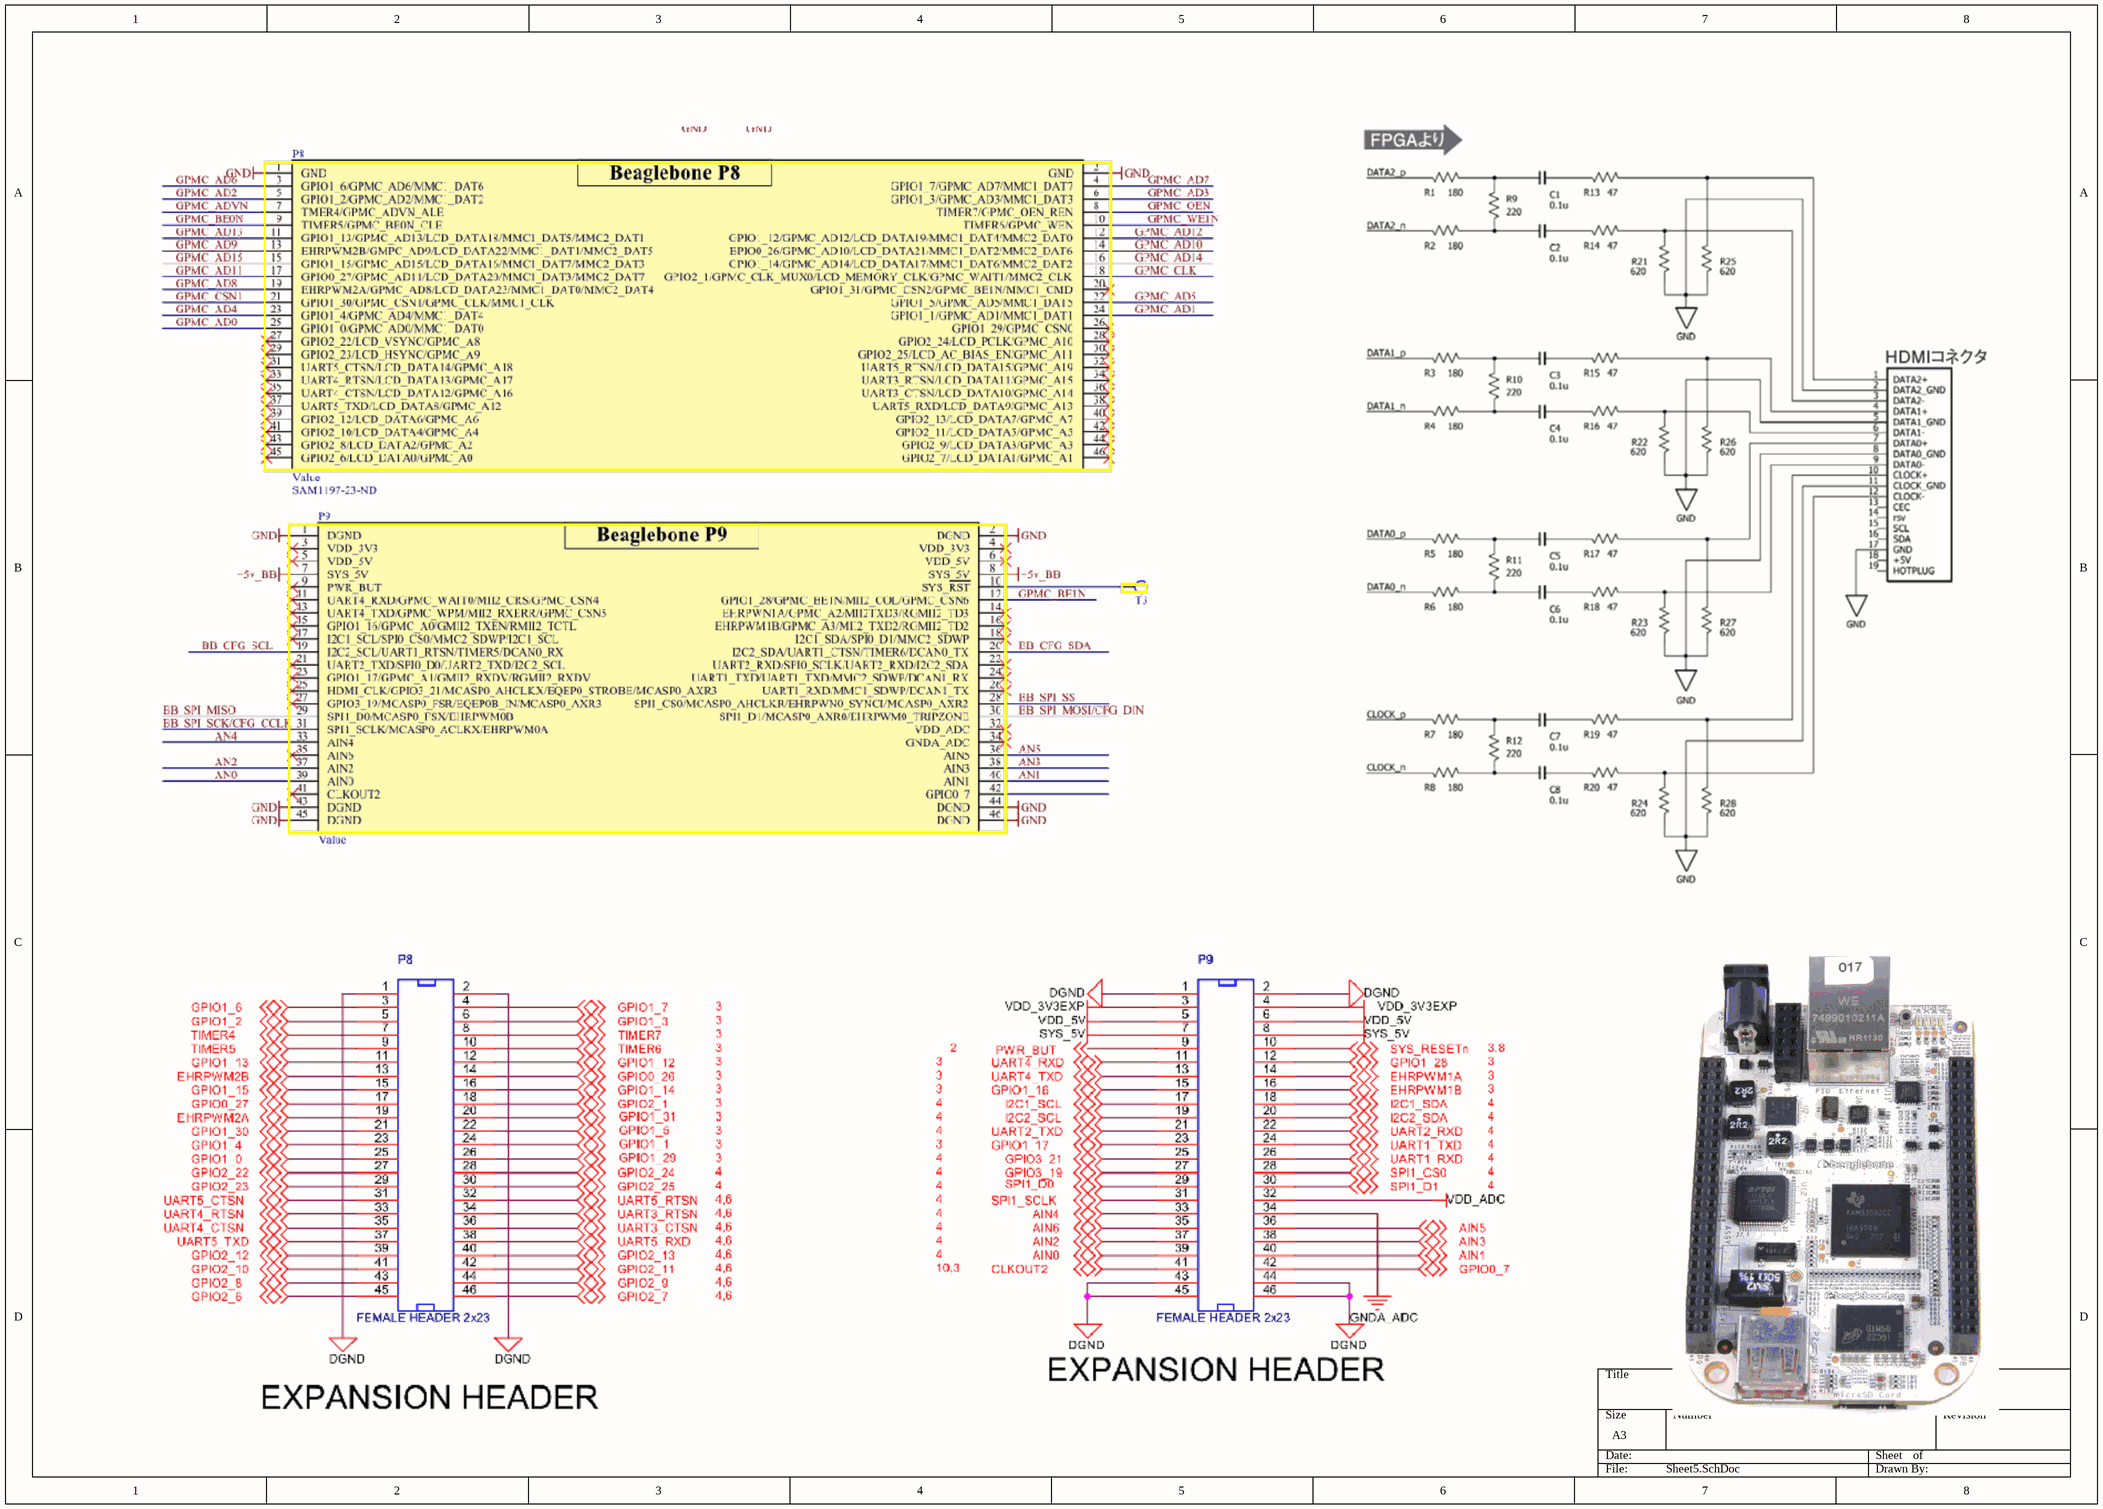
[diagram p3: Sheet5.SchDoc]

## Nets that join several sheets
3_3V: Sheet1 (9 pins), Sheet2 (80 pins), Sheet3 (10 pins)
5V: Sheet1 (C16.2 J3.2 U4.3), Sheet3 (R38.1 R44.1)
5V_IN: Sheet1 (J3.1), Sheet3 (J2.7 J2.8)
GND: Sheet1 (13 pins), Sheet2 (61 pins), Sheet3 (26 pins)
CONF_TCK: Sheet2 (CN1.1 R36.1 U5.18), Sheet3 (J2.33)
CONF_TDI: Sheet2 (CN1.9 R35.2 U5.19), Sheet3 (J2.37)
CONF_TDO: Sheet2 (CN1.3 U5.20), Sheet3 (J2.35)
CONF_TMS: Sheet2 (CN1.5 R34.2 U5.16), Sheet3 (J2.39)
DVI_CLK_N: Sheet2 (U5.106), Sheet3 (R29.1)
DVI_CLK_P: Sheet2 (U5.105), Sheet3 (R25.1)
DVI_D0_N: Sheet2 (U5.102), Sheet3 (R22.1)
DVI_D0_P: Sheet2 (U5.100), Sheet3 (R18.1)
DVI_D1_N: Sheet2 (U5.119), Sheet3 (R15.1)
DVI_D1_P: Sheet2 (U5.118), Sheet3 (R11.1)
DVI_D2_N: Sheet2 (U5.111), Sheet3 (R8.1)
DVI_D2_P: Sheet2 (U5.110), Sheet3 (R4.1)
GPIO0: Sheet2 (U5.6), Sheet3 (J1.4)
GPIO1: Sheet2 (U5.7), Sheet3 (J1.3)
GPIO2: Sheet2 (U5.8), Sheet3 (J1.6)
GPIO3: Sheet2 (U5.10), Sheet3 (J1.5)
GPIO4: Sheet2 (U5.11), Sheet3 (J1.8)
GPIO5: Sheet2 (U5.12), Sheet3 (J1.7)
GPIO6: Sheet2 (U5.13), Sheet3 (J1.10)
GPIO7: Sheet2 (U5.14), Sheet3 (J1.9)
GPIO8: Sheet2 (U5.114), Sheet3 (J1.12)
GPIO9: Sheet2 (U5.113), Sheet3 (J1.11)
GPIO10: Sheet2 (U5.120), Sheet3 (J1.14)
GPIO11: Sheet2 (U5.112), Sheet3 (J1.13)
GPIO12: Sheet2 (U5.101), Sheet3 (J1.16)
GPIO13: Sheet2 (U5.99), Sheet3 (J1.15)
GPIO14: Sheet2 (U5.131), Sheet3 (J1.18)
GPIO15: Sheet2 (U5.98), Sheet3 (J1.17)
GPIO16: Sheet2 (U5.97), Sheet3 (J1.20)
GPIO17: Sheet2 (U5.96), Sheet3 (J1.19)
GPIO18: Sheet2 (U5.93), Sheet3 (J1.22)
GPIO19: Sheet2 (U5.92), Sheet3 (J1.21)
GPIO20: Sheet2 (U5.91), Sheet3 (J1.24)
GPIO21: Sheet2 (U5.89), Sheet3 (J1.23)
GPIO22: Sheet2 (U5.88), Sheet3 (J1.26)
GPIO23: Sheet2 (U5.80), Sheet3 (J1.25)
GPIO24: Sheet2 (U5.66), Sheet3 (J1.28)
GPIO25: Sheet2 (U5.62), Sheet3 (J1.27 Q1.1)
GPIO26: Sheet2 (U5.135), Sheet3 (J1.30 Q2.1)
GPIO27: Sheet2 (U5.61), Sheet3 (J1.29 Q3.1)
GPIO28: Sheet2 (U5.132), Sheet3 (J1.32 Q4.1)
LED0: Sheet2 (U5.124), Sheet3 (LED2.2)
LED1: Sheet2 (U5.127), Sheet3 (LED1.2)
PIC_RB4: Sheet1 (U3.13), Sheet3 (J2.30 J2.36)
PIC_RB6: Sheet1 (U3.11), Sheet3 (J2.32 J2.34)
PIC_RC0: Sheet1 (U3.16), Sheet3 (J2.10 J2.31)
PIC_RC1: Sheet1 (U3.15), Sheet3 (J2.12 J2.40)
PIC_RC2: Sheet1 (U3.14), Sheet3 (J2.14)
PIC_RC3: Sheet1 (U3.7), Sheet3 (J2.16)
PIC_RC4: Sheet1 (U3.6), Sheet3 (J2.18 J2.23)
PIC_RC5: Sheet1 (U3.5), Sheet3 (J2.20)
PIC_RC6: Sheet1 (U3.8), Sheet3 (J2.22)
PIC_RC7: Sheet1 (U3.9), Sheet3 (J2.24 J2.38)
PIC_RX: Sheet1 (U3.12), Sheet2 (U5.141), Sheet3 (J2.26)
PIC_TX: Sheet1 (U3.10), Sheet2 (U5.140), Sheet3 (J2.28)
SW0: Sheet2 (U5.130), Sheet3 (R32.2 S1.1 S1.2)
SW1: Sheet2 (U5.123), Sheet3 (R33.2 S2.1 S2.2)